# EAGLE schematic working (EAGLE 9.1.3)
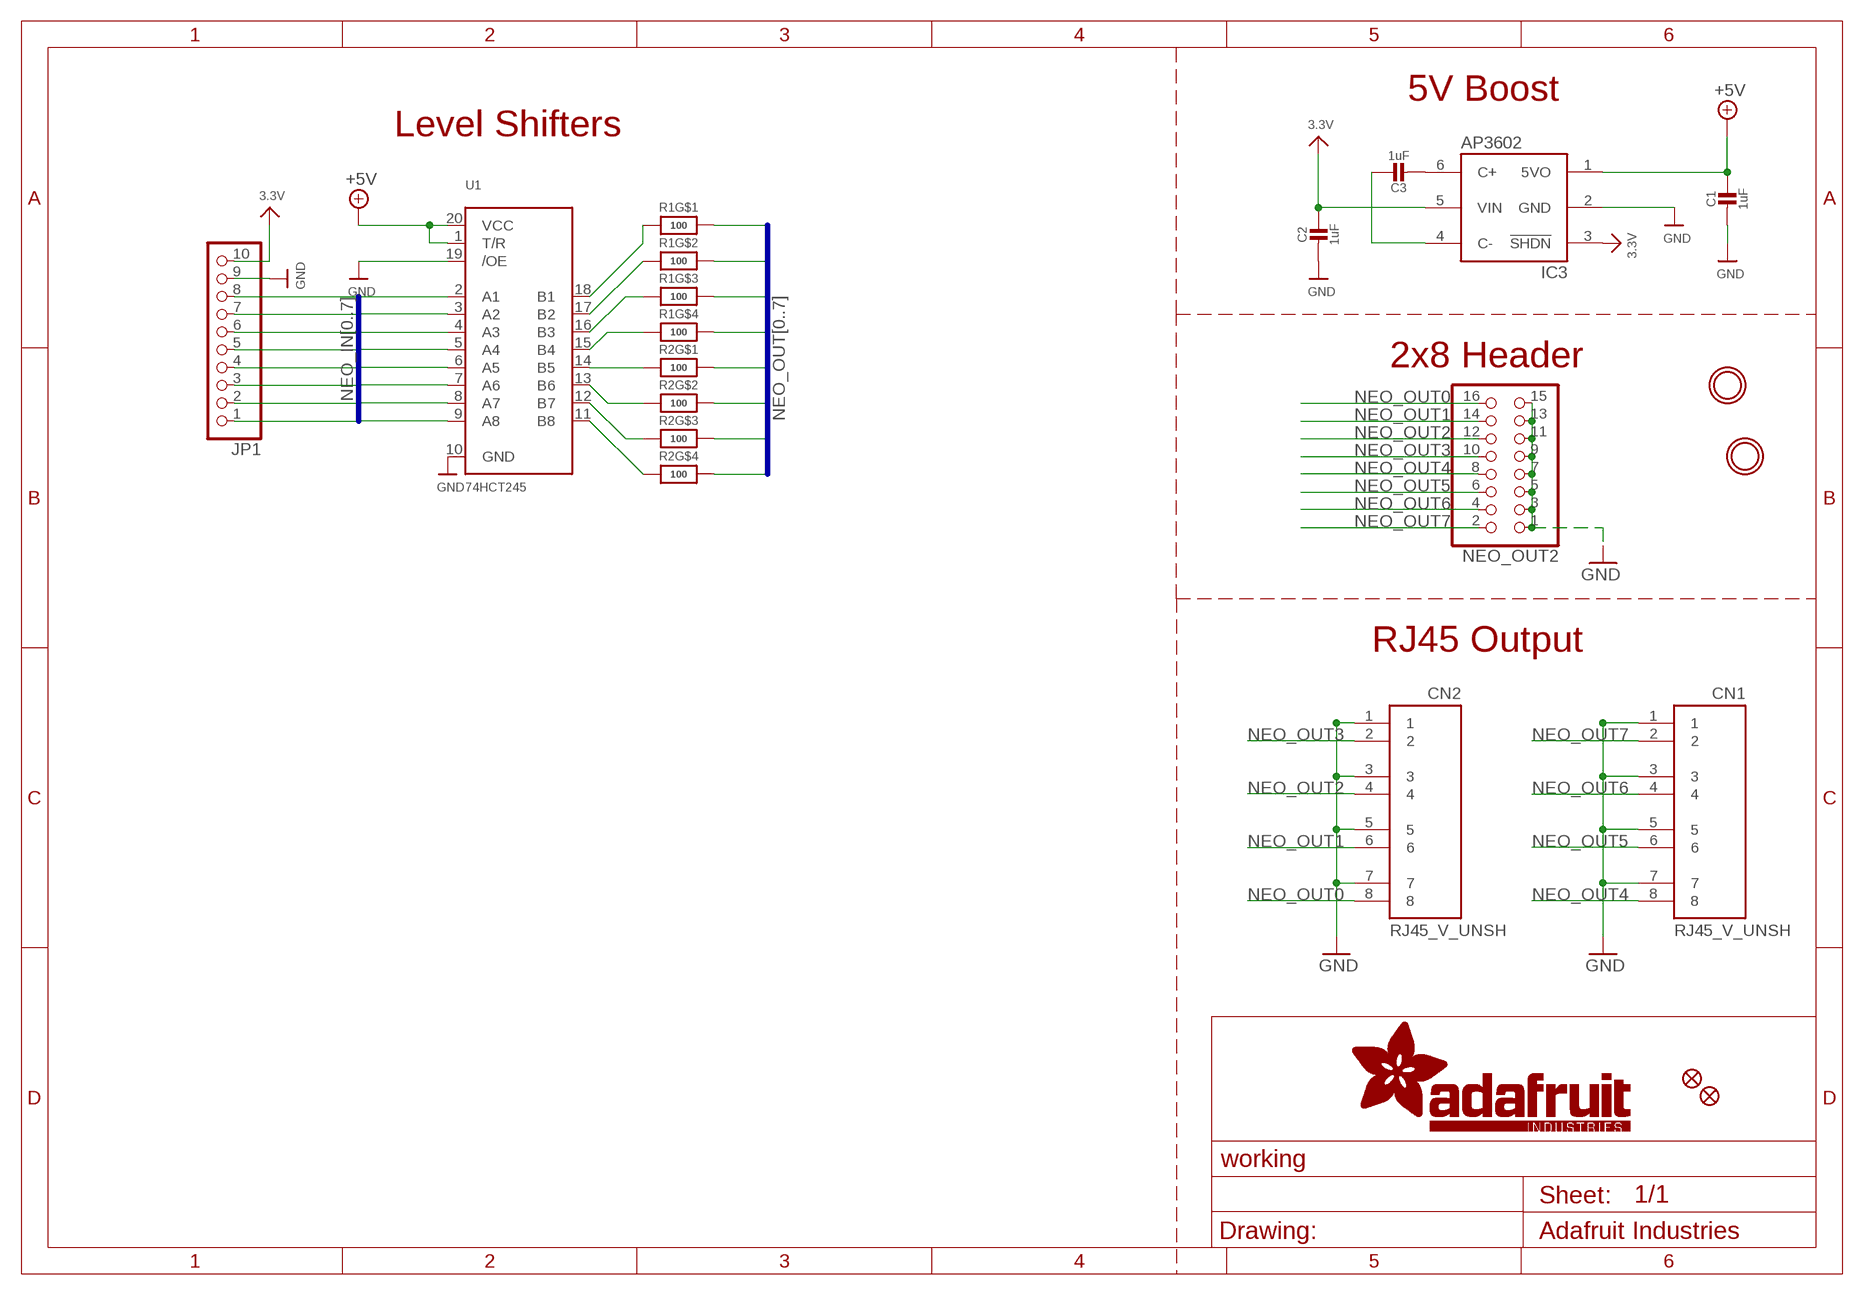
[diagram p0: schematic, sheet 1]

## Parts
C1  1uF  CAP_CERAMIC0603_NO  [0603-NO]
C2  1uF  CAP_CERAMIC0603_NO  [0603-NO]
C3  1uF  CAP_CERAMIC0603_NO  [0603-NO]
CN1  RJ45_V_UNSH  [RJ45_VERTICAL_UNSHIELDED]
CN2  RJ45_V_UNSH  [RJ45_VERTICAL_UNSHIELDED]
FID1  FIDUCIAL_1MM  [FIDUCIAL_1MM]
FID2  FIDUCIAL_1MM  [FIDUCIAL_1MM]
IC3  AP3602  [SOT23-6]
JP1  HEADER-1X1070MIL  [1X10_ROUND70]
NEO_OUT2  HEADER-2X8  [2X08]
R1  100  RESISTOR_4PACK  [RESPACK_4X0603]
R2  100  RESISTOR_4PACK  [RESPACK_4X0603]
U1  74HCT245  74LCX245  [TSSOP20]
U$3  MOUNTINGHOLE2.5  [MOUNTINGHOLE_2.5_PLATED]
U$7  MOUNTINGHOLE2.5  [MOUNTINGHOLE_2.5_PLATED]

## Nets
3.3V: C2.1 IC3.3(!SHDN) IC3.5(VIN) JP1.10
+5V: C1.1 IC3.1(5VO) U1.1(T/R) U1.20(VCC)
GND: C1.2 C2.2 CN1.1 CN1.3 CN1.5 CN1.7 CN2.1 CN2.3 CN2.5 CN2.7 IC3.2(GND) JP1.9 NEO_OUT2.1 NEO_OUT2.3 NEO_OUT2.5 NEO_OUT2.7 NEO_OUT2.9 NEO_OUT2.11 NEO_OUT2.13 NEO_OUT2.15 U1.10(GND) U1.19(/OE)
N$1: R2.4 U1.11(B8)
N$2: R2.3 U1.12(B7)
N$3: R2.2 U1.13(B6)
N$4: R2.1 U1.14(B5)
N$5: R1.4 U1.15(B4)
N$6: R1.3 U1.16(B3)
N$7: R1.2 U1.17(B2)
N$8: R1.1 U1.18(B1)
N$14: C3.2 IC3.6(C+)
N$15: C3.1 IC3.4(C-)
NEO_IN0: JP1.8 U1.2(A1)
NEO_IN1: JP1.7 U1.3(A2)
NEO_IN2: JP1.6 U1.4(A3)
NEO_IN3: JP1.5 U1.5(A4)
NEO_IN4: JP1.4 U1.6(A5)
NEO_IN5: JP1.3 U1.7(A6)
NEO_IN6: JP1.2 U1.8(A7)
NEO_IN7: JP1.1 U1.9(A8)
NEO_OUT0: CN2.8 NEO_OUT2.16 R1.8
NEO_OUT1: CN2.6 NEO_OUT2.14 R1.7
NEO_OUT2: CN2.4 NEO_OUT2.12 R1.6
NEO_OUT3: CN2.2 NEO_OUT2.10 R1.5
NEO_OUT4: CN1.8 NEO_OUT2.8 R2.8
NEO_OUT5: CN1.6 NEO_OUT2.6 R2.7
NEO_OUT6: CN1.4 NEO_OUT2.4 R2.6
NEO_OUT7: CN1.2 NEO_OUT2.2 R2.5

## Buses
NEO_OUT[0..7]
NEO_IN[0..7]

## Notes on the sheet
- 5V Boost
- Level Shifters
- 2x8 Header
- RJ45 Output

## Library data of the parts
C1-C3 = microbuilder:CAP_CERAMIC: Ceramic Capacitors For new designs, use the packages preceded by an '_' character since they are more reliable: The following footprints should be used on most boards: _0402 - Standard footprint for regular board layouts _0603 - Standard footprint for regular board layouts _0805 - Standard footprint for regular board layouts _1206 - Standard footprint for regular board layouts For extremely tight-pitch boards where space is at a premium, the following 'micro-pitch' footprints can be used (smaller pads, no silkscreen outline, etc.): _0402MP - Micro-pitch footprint for very dense/compact boards _0603MP - Micro-pitch footprint for very dense/compact boards _0805MP - Micro-pitch footprint for very dense/compact boards _1206MP - Micro-pitch footprint for very dense/compact boards
CN1 CN2 = microbuilder:RJ45
FID1 FID2 = microbuilder:FIDUCIAL: Fiducial Alignment Points Various fiducial points for machine vision alignment.; BOM: EXCLUDE
IC3 = microbuilder:AP3602
JP1 = microbuilder:HEADER-1X10: PIN HEADER
NEO_OUT2 = microbuilder:HEADER-2X8
R1 R2 = microbuilder:RESISTOR_4PACK: Resistor Packs (4 resistors) 4 x 0603 10K 1/16W - Digikey: YC164J-10KCT-ND
U1 = microbuilder:74LCX245: 74LCX245MTC - 5.0V Tolerant Bi-Directional Buffer Can be used to interface 5.0V logic to 2.5 or 3.3V devices Digikey: 74LCX245MTCXTR-ND Mouser: 512-74LCX245MTCX
U$3 U$7 = microbuilder:MOUNTINGHOLE: Mounting Hole For #2 screws (0.086"/2.18mm width, 0.094"/2.4mm hole) use 2.5mm; BOM: EXCLUDE